# Altium schematic sheet LCD.SchDoc
size 420 x 297 mm; Address1: Address1; Address2: Address2; Address3: Address3; Address4: Address4; DocumentNumber: Э3; SheetNumber: 4; SheetTotal: 5; Scale: 1:1; DocumentType: Схема электрическая принципиальная; FirstReferrence: АБВГ.123456.001
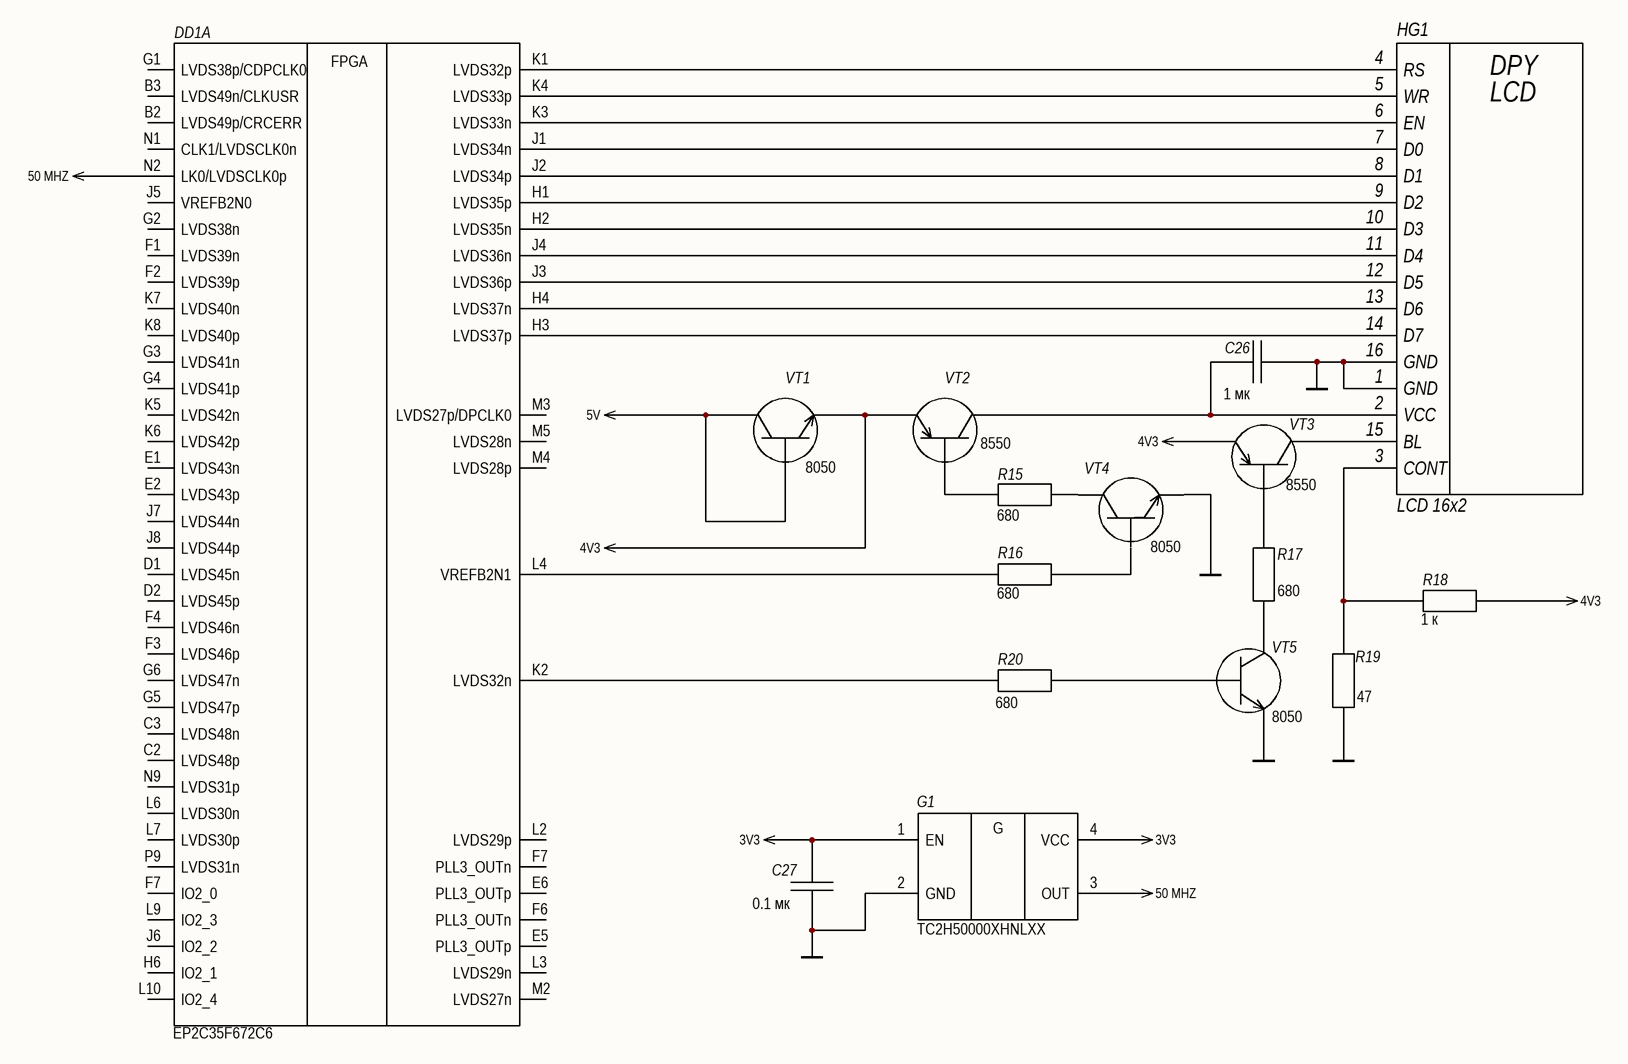
[diagram p0: LCD.SchDoc]

## Parts
C26  (no value)
C27  (no value)
DD1  EP2C35F672C6  (part A of 7)
G1  TC2H50000XHNLXX
HG1  LCD 16x2
R15  (no value)
R16  (no value)
R17  (no value)
R18  (no value)
R19  (no value)
R20  (no value)
VT1  Transistor  (value not drawn)
VT2  Transistor  (value not drawn)
VT3  Transistor  (value not drawn)
VT4  Transistor  (value not drawn)
VT5  Transistor  (value not drawn)

## Nets
3V3: C27.2 G1.1(EN) G1.4(VCC)
4V3: R18.2 VT1.2 VT2.2 VT3.2
5V: VT1.1 VT1.3
50 MHZ: DD1.N2(LK0/LVDSCLK0p) G1.3(OUT)
GND: C26.1 C27.1 G1.2(GND) HG1.1(GND) HG1.16(GND) R19.1 VT4.2 VT5.2
NetC26_2: C26.2 HG1.2(VCC) VT2.3
NetDD1_H1: DD1.H1(LVDS35p) HG1.9(D2)
NetDD1_H2: DD1.H2(LVDS35n) HG1.10(D3)
NetDD1_H3: DD1.H3(LVDS37p) HG1.14(D7)
NetDD1_H4: DD1.H4(LVDS37n) HG1.13(D6)
NetDD1_J1: DD1.J1(LVDS34n) HG1.7(D0)
NetDD1_J2: DD1.J2(LVDS34p) HG1.8(D1)
NetDD1_J3: DD1.J3(LVDS36p) HG1.12(D5)
NetDD1_J4: DD1.J4(LVDS36n) HG1.11(D4)
NetDD1_K1: DD1.K1(LVDS32p) HG1.4(RS)
NetDD1_K2: DD1.K2(LVDS32n) R20.1
NetDD1_K3: DD1.K3(LVDS33n) HG1.6(EN)
NetDD1_K4: DD1.K4(LVDS33p) HG1.5(WR)
NetDD1_L4: DD1.L4(VREFB2N1) R16.2
NetHG1_3: HG1.3(CONT) R18.1 R19.2
NetHG1_15: HG1.15(BL) VT3.3
NetR15_1: R15.1 VT4.3
NetR15_2: R15.2 VT2.1
NetR16_1: R16.1 VT4.1
NetR17_1: R17.1 VT5.3
NetR17_2: R17.2 VT3.1
NetR20_2: R20.2 VT5.1

Not connected (* = marked no-connect by the designer): DD1 B2(LVDS49p/CRCERR) B3(LVDS49n/CLKUSR) C2(LVDS48p) C3(LVDS48n) D1(LVDS45n) D2(LVDS45p) E1(LVDS43n) E2(LVDS43p) E5(PLL3_OUTp) E6(PLL3_OUTp) F1(LVDS39n) F2(LVDS39p) F3(LVDS46p) F4(LVDS46n) F6(PLL3_OUTn) F7(IO2_0) G1(LVDS38p/CDPCLK0) G2(LVDS38n) G3(LVDS41n) G4(LVDS41p) G5(LVDS47p) G6(LVDS47n) H6(IO2_1) J5(VREFB2N0) J6(IO2_2) J7(LVDS44n) J8(LVDS44p) K5(LVDS42n) K6(LVDS42p) K7(LVDS40n) K8(LVDS40p) L2(LVDS29p) L3(LVDS29n) L6(LVDS30n) L7(LVDS30p) L9(IO2_3) L10(IO2_4) M2(LVDS27n) M3(LVDS27p/DPCLK0) M4(LVDS28p) M5(LVDS28n) N1(CLK1/LVDSCLK0n) N9(LVDS31p) P9(LVDS31n)

## Notes on the sheet
- 1 мк
- (near VT1) 8050
- (near VT2) 8550
- (near VT3) 8550
- (near R15) 680
- (near VT4) 8050
- (near R16) 680
- (near R17) 680
- (near R18) 1 к
- (near R20) 680
- (near VT5) 8050
- (near R19) 47
- (near C27) 0.1 мк
- Подп. и дата
- Инв. № дубл.
- Взам. инв. №
- Инв. № подл.
- Изм.
- Лист
- № докум.
- Подп.
- Дата
- 2.106-A3
- Копировал
- Формат А3
- (in symbol Generator) G
- (in symbol LCD Display) DPY; LCD
- (in symbol PLIS, part A) FPGA

## Library data of the parts
C26 C27 = C: ValueType: Конденсатор
DD1 = PLIS
G1 = Generator
HG1 = LCD Display
R15-R20 = R